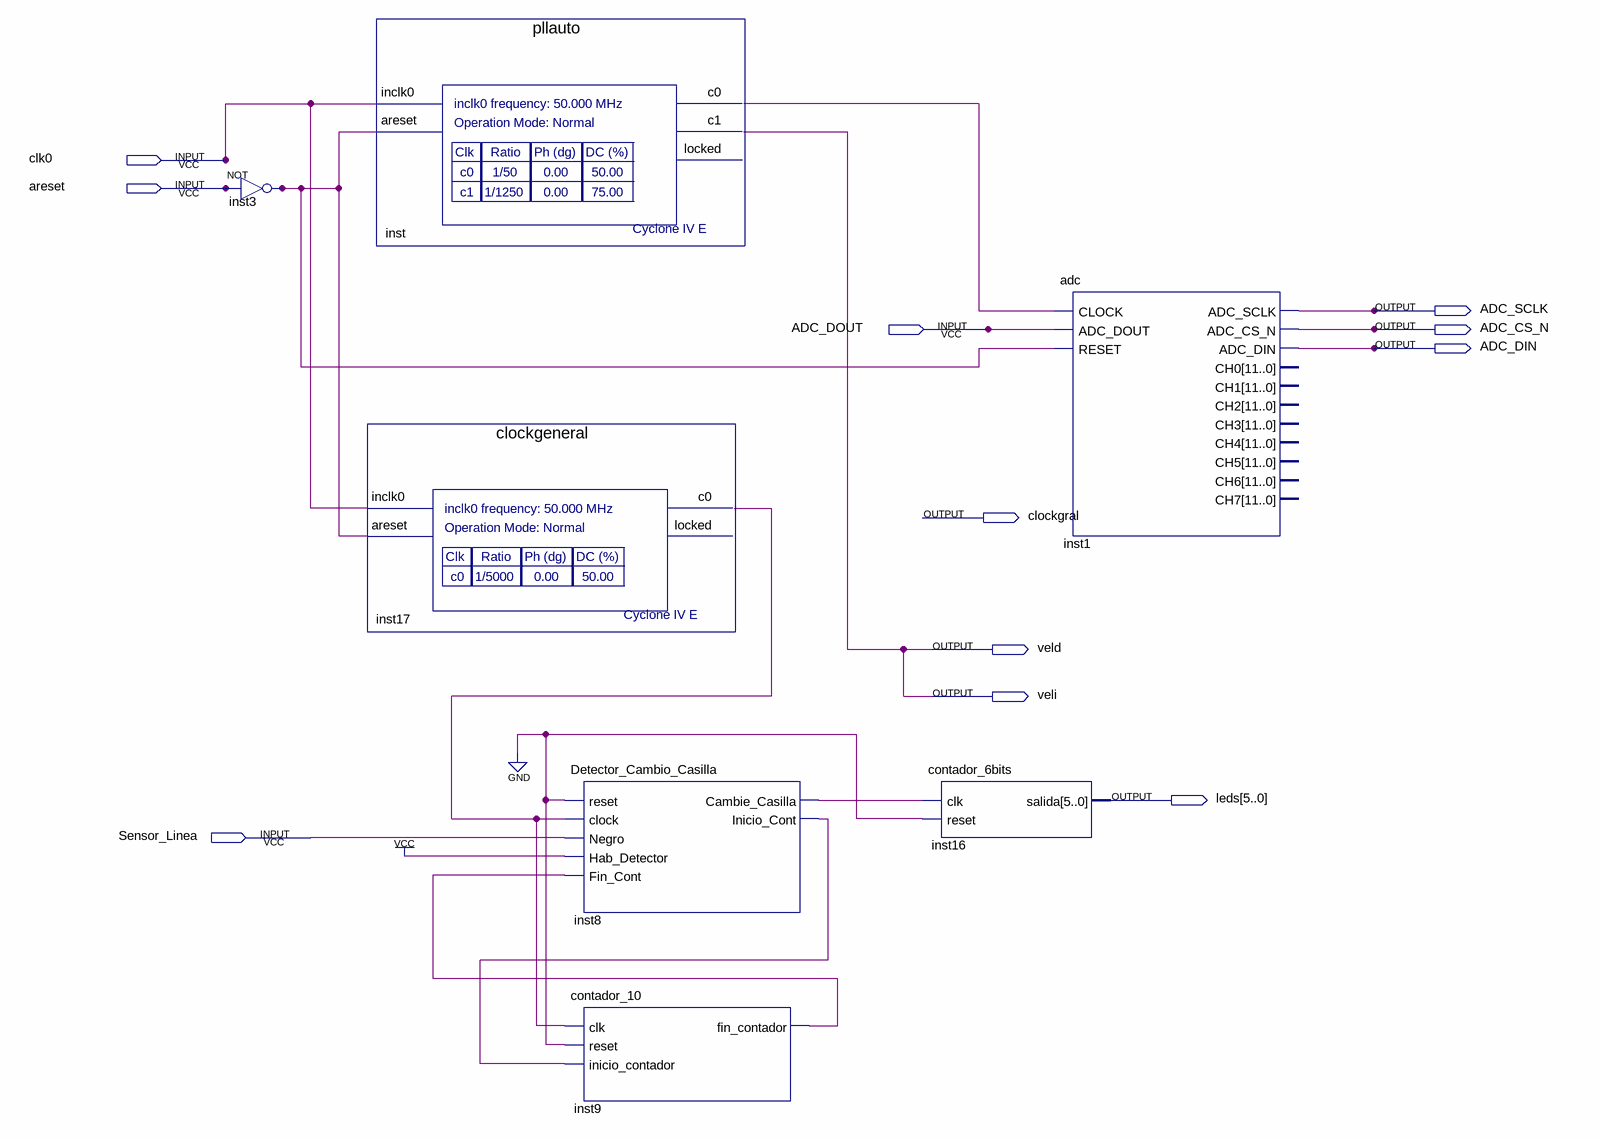
[diagram p0: schematic sheet]
// Quartus schematic Prueba_de_Linea.bdf as structural Verilog: 7 symbols, 11 pins
module Prueba_de_Linea (
  input  clk0,
  input  areset,
  input  ADC_DOUT,
  input  Sensor_Linea,
  output ADC_SCLK,
  output ADC_CS_N,
  output ADC_DIN,
  output clockgral,
  output veld,
  output veli,
  output [5:0] leds
);

  wire inst3_out, inst8_cambie_casilla, inst8_inicio_cont, inst9_fin_contador, inst17_c0, inst_c0;

  not inst3 (inst3_out, areset);
  pllauto inst (.inclk0(clk0), .areset(inst3_out), .c0(inst_c0), .c1(veld));  // open: locked
  clockgeneral inst17 (.inclk0(clk0), .areset(inst3_out), .c0(inst17_c0));  // open: locked
  Detector_Cambio_Casilla inst8 (
    .reset(1'b0), .clock(inst17_c0), .Negro(Sensor_Linea), .Hab_Detector(1'b1),
    .Fin_Cont(inst9_fin_contador), .Cambie_Casilla(inst8_cambie_casilla), .Inicio_Cont(inst8_inicio_cont));
  contador_10 inst9 (
    .clk(inst17_c0), .reset(1'b0), .inicio_contador(inst8_inicio_cont), .fin_contador(inst9_fin_contador));
  contador_6bits inst16 (.clk(inst8_cambie_casilla), .reset(1'b0), .salida(leds));
  adc inst1 (
    .CLOCK(inst_c0), .ADC_DOUT(ADC_DOUT), .RESET(inst3_out), .ADC_SCLK(ADC_SCLK), .ADC_CS_N(ADC_CS_N),
    .ADC_DIN(ADC_DIN));  // open: CH0, CH1, CH2, CH3, CH4, CH5, CH6, CH7

  assign veli = veld;
endmodule
